# Altium schematic sheet DSP.SchDoc
size A3; SheetNumber: 5; SheetTotal: 5
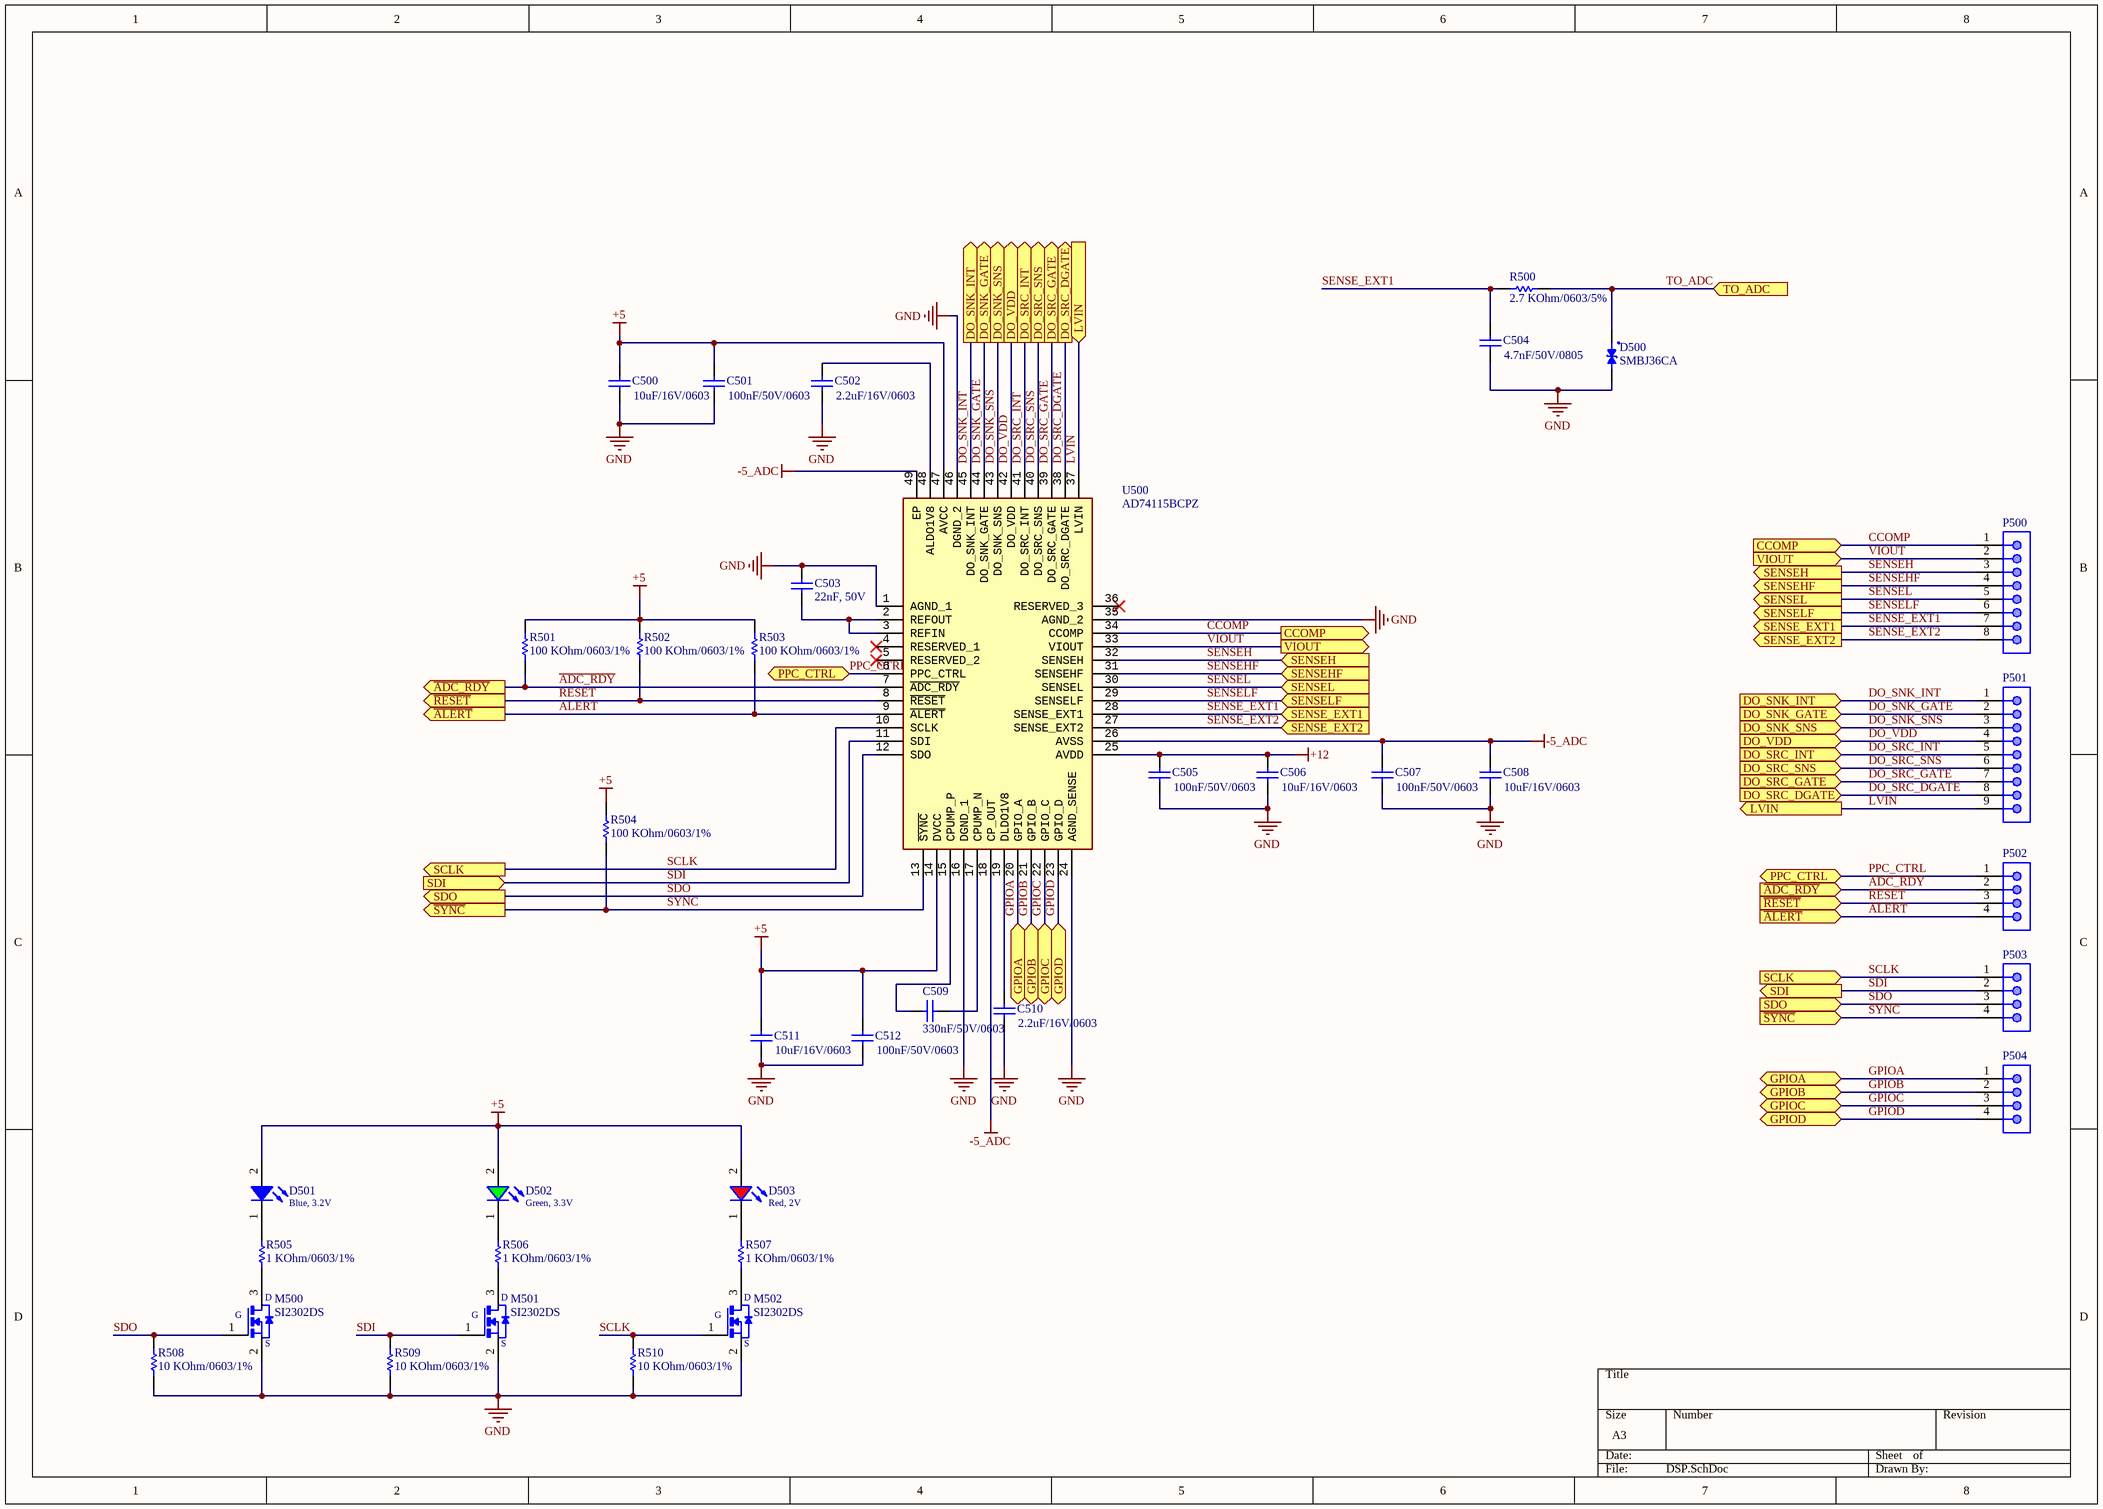
[diagram p0: DSP.SchDoc]

## Parts
C500  value 10uF/16V/0603  [WCAP-CSGP_0603_H=0.8mm_Reflow]  (hidden comment: 10uF, 6.3V)
C501  Capacitance: 100nF/50V/0603  [WCAP-CSGP_0603_H=0.8mm_Reflow]  (hidden comment: 100nF, 50V)
C502  value 2.2uF/16V/0603  [WCAP-CSGP_0603_H=0.8mm_Reflow]  (hidden comment: 2.2uF, 16V)
C503  22nF, 50V  [WCAP-CSGP_0603_H=0.8mm_Reflow]
C504  Capacitance: 4.7nF/50V/0805  [WCAP-CSGP_0805_H=1.25mm]  (hidden comment: 4.7nF, 100V)
C505  Capacitance: 100nF/50V/0603  [WCAP-CSGP_0603_H=0.8mm_Reflow]  (hidden comment: 100nF, 50V)
C506  value 10uF/16V/0603  [WCAP-CSGP_0603_H=0.8mm_Reflow]  (hidden comment: 10uF, 6.3V)
C507  Capacitance: 100nF/50V/0603  [WCAP-CSGP_0603_H=0.8mm_Reflow]  (hidden comment: 100nF, 50V)
C508  value 10uF/16V/0603  [WCAP-CSGP_0603_H=0.8mm_Reflow]  (hidden comment: 10uF, 6.3V)
C509  value 330nF/50V/0603  [WCAP-CSGP_0603_H=0.8mm_Reflow]  (hidden comment: 330nF, 50V)
C510  value 2.2uF/16V/0603  [WCAP-CSGP_0603_H=0.8mm_Reflow]  (hidden comment: 2.2uF, 16V)
C511  value 10uF/16V/0603  [WCAP-CSGP_0603_H=0.8mm_Reflow]  (hidden comment: 10uF, 6.3V)
C512  Capacitance: 100nF/50V/0603  [WCAP-CSGP_0603_H=0.8mm_Reflow]  (hidden comment: 100nF, 50V)
D500  SMBJ36CA  [DIOM4336X265N]
D501  Blue, 3.2V  [WL-SMCW_0603 dome]
D502  Green, 3.3V  [WL-SMCW_0603 dome]
D503  Red, 2V  [WL-SMCW_0603 dome]
M500  value SI2302DS  [SOT23]  (hidden comment: SI2302)
M501  value SI2302DS  [SOT23]  (hidden comment: SI2302)
M502  value SI2302DS  [SOT23]  (hidden comment: SI2302)
P500  61300811121  [61300811121]  (value not drawn)
P501  61300911121  [61300911121]  (value not drawn)
P502  61300411121  [61300411121]  (value not drawn)
P503  61300411121  [61300411121]  (value not drawn)
P504  61300411121  [61300411121]  (value not drawn)
R500  value 2.7 KOhm/0603/5%  [R0603]  (hidden comment: Resistor 2.7 KOhm 0603 5%)
R501  value 100 KOhm/0603/1%  [R0603]  (hidden comment: Resistor 100 KOhm 0603 1%)
R502  value 100 KOhm/0603/1%  [R0603]  (hidden comment: Resistor 100 KOhm 0603 1%)
R503  value 100 KOhm/0603/1%  [R0603]  (hidden comment: Resistor 100 KOhm 0603 1%)
R504  value 100 KOhm/0603/1%  [R0603]  (hidden comment: Resistor 100 KOhm 0603 1%)
R505  value 1 KOhm/0603/1%  [R0603]  (hidden comment: Resistor 1 KOhm 0603 1%)
R506  value 1 KOhm/0603/1%  [R0603]  (hidden comment: Resistor 1 KOhm 0603 1%)
R507  value 1 KOhm/0603/1%  [R0603]  (hidden comment: Resistor 1 KOhm 0603 1%)
R508  value 10 KOhm/0603/1%  [R0603]  (hidden comment: Resistor 10 KOhm 0603 1%)
R509  value 10 KOhm/0603/1%  [R0603]  (hidden comment: Resistor 10 KOhm 0603 1%)
R510  value 10 KOhm/0603/1%  [R0603]  (hidden comment: Resistor 10 KOhm 0603 1%)
U500  AD74115BCPZ  [QFN50P700X700X80-49N-D]

## Ports
CCOMP (in), CCOMP (out), DO_SNK_GATE (in), DO_SNK_GATE (out), DO_SNK_INT (in), DO_SNK_INT (out), DO_SNK_SNS (in), DO_SNK_SNS (out), DO_SRC_DGATE (in), DO_SRC_DGATE (out), DO_SRC_GATE (in), DO_SRC_GATE (out), DO_SRC_INT (in), DO_SRC_INT (out), DO_SRC_SNS (in), DO_SRC_SNS (out), DO_VDD (in), DO_VDD (out), GPIOA (bidir), GPIOB (bidir), GPIOC (bidir), GPIOD (bidir), LVIN (in), LVIN (out), PPC_CTRL (bidir), SCLK (in), SCLK (out), SDI (in), SDI (out), SDO (in), SDO (out), SENSE_EXT1 (in), SENSE_EXT1 (out), SENSE_EXT2 (in), SENSE_EXT2 (out), SENSEH (in), SENSEH (out), SENSEHF (in), SENSEHF (out), SENSEL (in), SENSEL (out), SENSELF (in), SENSELF (out), TO_ADC (in), VIOUT (in), VIOUT (out), ~{ADC_RDY} (in), ~{ADC_RDY} (out), ~{ALERT} (in), ~{ALERT} (out), ~{RESET} (in), ~{RESET} (out), ~{SYNC} (in), ~{SYNC} (out)

## Nets
+5: C500.2 C501.2 C511.2 C512.2 D501.2(A) D502.2(A) D503.2(A) R501.2 R502.2 R503.2 R504.1 U500.14(DVCC) U500.47(AVCC)
+12: C505.2 C506.2 U500.25(AVDD)
-5_ADC: C507.2 C508.2 U500.18(CP_OUT) U500.26(AVSS) U500.49(EP)
GND: C500.1 C501.1 C502.1 C503.2 C504.1 C505.1 C506.1 C507.1 C508.1 C510.1 C511.1 C512.1 D500.2 M500.2(S) M501.2(S) M502.2(S) R508.1 R509.1 R510.1 U500.1(AGND_1) U500.16(DGND_1) U500.24(AGND_SENSE) U500.35(AGND_2) U500.46(DGND_2)
~{ADC_RDY}: P502.2 R501.1 U500.7(~{ADC_RDY}) ; port ~{ADC_RDY}
~{ALERT}: P502.4 R503.1 U500.9(~{ALERT}) ; port ~{ALERT}
CCOMP: P500.1 U500.34(CCOMP) ; port CCOMP
DO_SNK_GATE: P501.2 U500.44(DO_SNK_GATE) ; port DO_SNK_GATE
DO_SNK_INT: P501.1 U500.45(DO_SNK_INT) ; port DO_SNK_INT
DO_SNK_SNS: P501.3 U500.43(DO_SNK_SNS) ; port DO_SNK_SNS
DO_SRC_DGATE: P501.8 U500.38(DO_SRC_DGATE) ; port DO_SRC_DGATE
DO_SRC_GATE: P501.7 U500.39(DO_SRC_GATE) ; port DO_SRC_GATE
DO_SRC_INT: P501.5 U500.41(DO_SRC_INT) ; port DO_SRC_INT
DO_SRC_SNS: P501.6 U500.40(DO_SRC_SNS) ; port DO_SRC_SNS
DO_VDD: P501.4 U500.42(DO_VDD) ; port DO_VDD
GPIOA: P504.1 U500.20(GPIO_A) ; port GPIOA
GPIOB: P504.2 U500.21(GPIO_B) ; port GPIOB
GPIOC: P504.3 U500.22(GPIO_C) ; port GPIOC
GPIOD: P504.4 U500.23(GPIO_D) ; port GPIOD
LVIN: P501.9 U500.37(LVIN) ; port LVIN
PPC_CTRL: P502.1 U500.6(PPC_CTRL) ; port PPC_CTRL
~{RESET}: P502.3 R502.1 U500.8(~{RESET}) ; port ~{RESET}
~{SYNC}: P503.4 R504.2 U500.13(~{SYNC}) ; port ~{SYNC}
SCLK: M502.1(G) P503.1 R510.2 U500.10(SCLK) ; port SCLK
SDI: M501.1(G) P503.2 R509.2 U500.11(SDI) ; port SDI
SDO: M500.1(G) P503.3 R508.2 U500.12(SDO) ; port SDO
SENSE_EXT1: C504.2 P500.7 R500.1 U500.28(SENSE_EXT1) ; port SENSE_EXT1
SENSE_EXT2: P500.8 U500.27(SENSE_EXT2) ; port SENSE_EXT2
SENSEH: P500.3 U500.32(SENSEH) ; port SENSEH
SENSEHF: P500.4 U500.31(SENSEHF) ; port SENSEHF
SENSEL: P500.5 U500.30(SENSEL) ; port SENSEL
SENSELF: P500.6 U500.29(SENSELF) ; port SENSELF
TO_ADC: D500.1 R500.2 ; port TO_ADC
VIOUT: P500.2 U500.33(VIOUT) ; port VIOUT
NetC502_2: C502.2 U500.48(ALDO1V8)
NetC503_1: C503.1 U500.2(REFOUT) U500.3(REFIN)
NetC509_1: C509.1 U500.17(CPUMP_N)
NetC509_2: C509.2 U500.15(CPUMP_P)
NetC510_2: C510.2 U500.19(DLDO1V8)
NetD501_1: D501.1(K) R505.2
NetD502_1: D502.1(K) R506.2
NetD503_1: D503.1(K) R507.2
NetM500_3: M500.3(D) R505.1
NetM501_3: M501.3(D) R506.1
NetM502_3: M502.3(D) R507.1

Not connected (* = marked no-connect by the designer): U500 4(RESERVED_1)* 5(RESERVED_2)* 36(RESERVED_3)*

## Library data of the parts
C500 C506 C508 C511 = 885012106006: WCAP-CSGP Multilayer Ceramic Chip Capacitor, General Purpose, size 0603, X5R, 10uF, 6.3V; Manufacturer: Wurth Elektronik; Rated Voltage: 6.3VDC; Isolation Resistance: >=0.01GOhm; Capacitance Tolerance: +/-20%; Technical Reference: X5R0603106M6R3DFCT10000; ComponentLink1Description: Manufacturer; ComponentLink1URL: http://www.we-online.de; ComponentLink2Description: Datasheet; ComponentLink2URL: https://www.we-online.com/catalog/datasheet/885012106006.pdf; Operating Temperature: -55 to +85degC; Packaging: Tape and Reel; Manufacturer Part Number: 885012106006; Published Date: May 2020; Ceramic Type: X5R; Dissipation Factor: =<10%; Height: 0.8mm; Mounting Technology: SMT; Size: 0603
C501 C505 C507 C512 = 885012206095: WCAP-CSGP Multilayer Ceramic Chip Capacitor, General Purpose, size 0603, X7R, 100nF, 50V; Manufacturer: Wurth Elektronik; Rated Voltage: 50VDC; Isolation Resistance: >=5GOhm; Capacitance Tolerance: +/-10%; Technical Reference: X7R0603104K050DFCT10000; ComponentLink1Description: Manufacturer; ComponentLink1URL: http://www.we-online.de; ComponentLink2Description: Datasheet; ComponentLink2URL: https://www.we-online.com/catalog/datasheet/885012206095.pdf; Operating Temperature: -55 to +125degC; Packaging: Tape and Reel; Manufacturer Part Number: 885012206095; Published Date: May 2020; Ceramic Type: X7R; Dissipation Factor: =<3%; Height: 0.8mm; Mounting Technology: SMT; Size: 0603
C502 C510 = 885012106018: WCAP-CSGP Multilayer Ceramic Chip Capacitor, General Purpose, size 0603, X5R, 2.2uF, 16V; Manufacturer: Wurth Elektronik; Rated Voltage: 16VDC; Isolation Resistance: >=0.05GOhm; Capacitance Tolerance: +/-20%; Technical Reference: X5R0603225M016DFCT10000; ComponentLink1Description: Manufacturer; ComponentLink1URL: http://www.we-online.de; ComponentLink2Description: Datasheet; ComponentLink2URL: https://www.we-online.com/catalog/datasheet/885012106018.pdf; Operating Temperature: -55 to +85degC; Packaging: Tape and Reel; Manufacturer Part Number: 885012106018; Published Date: May 2020; Ceramic Type: X5R; Dissipation Factor: =<10%; Height: 0.8mm; Mounting Technology: SMT; Size: 0603
C503 = 885012206091: WCAP-CSGP Multilayer Ceramic Chip Capacitor, General Purpose, size 0603, X7R, 22nF, 50V; Manufacturer: Wurth Elektronik; Rated Voltage: 50VDC; Isolation Resistance: >=10GOhm; Capacitance Tolerance: +/-10%; Technical Reference: X7R0603223K050DFCT10000; ComponentLink1Description: Manufacturer; ComponentLink1URL: http://www.we-online.de; ComponentLink2Description: Datasheet; ComponentLink2URL: https://www.we-online.com/catalog/datasheet/885012206091.pdf; Operating Temperature: -55 to +125degC; Packaging: Tape and Reel; Manufacturer Part Number: 885012206091; Published Date: May 2020; Ceramic Type: X7R; Dissipation Factor: =<2.5%; Height: 0.8mm; Mounting Technology: SMT; Size: 0603; Capacitance: 22nF
C504 = 885012007092: WCAP-CSGP Multilayer Ceramic Chip Capacitor, General Purpose, size 0805, NP0, 4.7nF, 100V; Manufacturer: Wurth Elektronik; Rated Voltage: 100VDC; Isolation Resistance: >=10GOhm; Capacitance Tolerance: +/-5%; Dissipation Factor: Q>=1000; Technical Reference: NP00805472J100DFCT10000; ComponentLink1Description: Manufacturer; ComponentLink1URL: http://www.we-online.de; ComponentLink2Description: Datasheet; ComponentLink2URL: https://www.we-online.com/catalog/datasheet/885012007092.pdf; Operating Temperature: -55 to +125degC; Packaging: Tape and Reel; Manufacturer Part Number: 885012007092; Published Date: May 2020; Ceramic Type: NP0; Height: 1.25mm; Mounting Technology: SMT; Size: 0805
C509 = 885012206121: WCAP-CSGP Multilayer Ceramic Chip Capacitor, General Purpose, size 0603, X7R, 330nF, 50V; Manufacturer: Wurth Elektronik; Rated Voltage: 50VDC; Isolation Resistance: >=1.5GOhm; Capacitance Tolerance: +/-10%; Technical Reference: X7R0603334K050DFCT10000; ComponentLink1Description: Manufacturer; ComponentLink1URL: http://www.we-online.de; ComponentLink2Description: Datasheet; ComponentLink2URL: https://www.we-online.com/catalog/datasheet/885012206121.pdf; Operating Temperature: -55 to +125degC; Packaging: Tape and Reel; Manufacturer Part Number: 885012206121; Published Date: May 2020; Ceramic Type: X7R; Dissipation Factor: =<10%; Height: 0.8mm; Mounting Technology: SMT; Size: 0603
D500 = SMBJ36CA: 600W, 42.1V, 5%, Bidirectional, TVS; MF: Taiwan Semiconductor; SnapEDA_Link: https://www.snapeda.com/parts/SMBJ36CA/Taiwan+Semiconductor/view-part/?ref=snap; Package: SMB Taiwan Semiconductor; MP: SMBJ36CA; Check_prices: https://www.snapeda.com/parts/SMBJ36CA/Taiwan+Semiconductor/view-part/?ref=eda; Purchase-URL: https://pricing.snapeda.com/search/part/SMBJ36CA/?ref=eda; Price: None; Availability: In Stock; ComponentLink1Description: Buy; ComponentLink1URL: https://www.thegioiic.com/smbj36ca; Value: SMBJ36CA
D501 = 150060BS84000: WL-SMCW SMT Mono-color Chip LED Waterclear, size 0603 dome, Blue, 3.2V, 40deg; Chip Technology: InGaN; Dominant Wavelength typ.: 470nm; Luminous Intensity typ.: 560mcd; Peak Wavelength typ.: 465nm; Viewing Angle: 40deg; ComponentLink1Description: Manufacturer; ComponentLink1URL: http://www.we-online.de; ComponentLink2URL: https://www.we-online.com/catalog/datasheet/150060BS84000.pdf; ComponentLink2Description: Datasheet; Forward Voltage typ.: 3.2V; Emitting Color: Blue; Mounting Technology: SMT; Operating Temperature: -40 to +85degC; Published Date: December 2019; Part Number: 150060BS84000; Packaging: Tape and Reel; Size: 0603 dome; Publisher: Wurth Elektronik
D502 = 150060GS84000: WL-SMCW SMT Mono-color Chip LED Waterclear, size 0603 dome, Green, 3.3V, 40deg; Chip Technology: InGaN; Dominant Wavelength typ.: 525nm; Luminous Intensity typ.: 3000mcd; Peak Wavelength typ.: 520nm; Viewing Angle: 40deg; ComponentLink1Description: Manufacturer; ComponentLink1URL: http://www.we-online.de; ComponentLink2URL: https://www.we-online.com/catalog/datasheet/150060GS84000.pdf; ComponentLink2Description: Datasheet; Forward Voltage typ.: 3.3V; Emitting Color: Green; Mounting Technology: SMT; Operating Temperature: -40 to +85degC; Published Date: December 2019; Part Number: 150060GS84000; Packaging: Tape and Reel; Size: 0603 dome; Publisher: Wurth Elektronik
D503 = 150060RS86000: WL-SMCW SMT Mono-color Chip LED Waterclear, size 0603 dome, Red, 2V, 60deg; Chip Technology: AlInGaP; Dominant Wavelength typ.: 624nm; Luminous Intensity typ.: 800mcd; Peak Wavelength typ.: 632nm; Viewing Angle: 60deg; ComponentLink1Description: Manufacturer; ComponentLink1URL: http://www.we-online.de; ComponentLink2URL: https://www.we-online.com/catalog/datasheet/150060RS86000.pdf; ComponentLink2Description: Datasheet; Forward Voltage typ.: 2V; Emitting Color: Red; Mounting Technology: SMT; Operating Temperature: -40 to +85degC; Published Date: December 2019; Part Number: 150060RS86000; Packaging: Tape and Reel; Size: 0603 dome; Publisher: Wurth Elektronik
M500-M502 = SI2302: N-Channel 20 V 2.6A (Ta) 710mW (Ta) Surface Mount SOT-23-3 (TO-236); MF: Vishay Siliconix; Price: None; Availability: In Stock; Package: SOT-23-3 Vishay Siliconix; MP: SI2302; SnapEDA_Link: https://www.snapeda.com/parts/SI2302/Vishay+Siliconix/view-part/?ref=snap; Purchase-URL: https://pricing.snapeda.com/search/part/SI2302/?ref=eda; Check_prices: https://www.snapeda.com/parts/SI2302/Vishay+Siliconix/view-part/?ref=eda; ComponentLink1Description: Buy; ComponentLink1URL: https://www.thegioiic.com/si2302ds-mosfet-kenh-n-20v-2-5a-sot23
P500 = 61300811121: WR-PHD Pin Header, THT, pitch 2.54mm, Single Row, Vertical, 8p; Manufacturer: Wurth Elektronik; Pin Number: 8; Rated Current: 3A; Working Voltage: 250VAC; Withstanding Voltage: 500VAC; Contact Resistance: 20mOhm; ComponentLink1Description: Manufacturer; ComponentLink1URL: http://www.we-online.de; ComponentLink2Description: Datasheet; ComponentLink2URL: https://www.we-online.com/catalog/datasheet/61300811121.pdf; Manufacturer Part Number: 61300811121; Published Date: May 2020; Pitch: 2.54mm; Operating Temperature: -40 to +105degC; Mounting Technology: THT; Packaging: Bag; Gender: Pin Header; Row Number: Single; Orientation: Vertical
P501 = 61300911121: WR-PHD Pin Header, THT, pitch 2.54mm, Single Row, Vertical, 9p; Manufacturer: Wurth Elektronik; Pin Number: 9; Rated Current: 3A; Working Voltage: 250VAC; Withstanding Voltage: 500VAC; Contact Resistance: 20mOhm; ComponentLink1Description: Manufacturer; ComponentLink1URL: http://www.we-online.de; ComponentLink2Description: Datasheet; ComponentLink2URL: https://www.we-online.com/catalog/datasheet/61300911121.pdf; Manufacturer Part Number: 61300911121; Published Date: May 2020; Pitch: 2.54mm; Operating Temperature: -40 to +105degC; Mounting Technology: THT; Packaging: Bag; Gender: Pin Header; Row Number: Single; Orientation: Vertical
P502-P504 = 61300411121: WR-PHD Pin Header, THT, pitch 2.54mm, Single Row, Vertical, 4p; Manufacturer: Wurth Elektronik; Pin Number: 4; Rated Current: 3A; Working Voltage: 250VAC; Withstanding Voltage: 500VAC; Contact Resistance: 20mOhm; ComponentLink1Description: Manufacturer; ComponentLink1URL: http://www.we-online.de; ComponentLink2Description: Datasheet; ComponentLink2URL: https://www.we-online.com/catalog/datasheet/61300411121.pdf; Manufacturer Part Number: 61300411121; Published Date: May 2020; Pitch: 2.54mm; Operating Temperature: -40 to +105degC; Mounting Technology: THT; Packaging: Bag; Gender: Pin Header; Row Number: Single; Orientation: Vertical
R500 = Resistor 2.7 KOhm 0603 5%: Code 272, 1/10W; ComponentLink1Description: Buy; ComponentLink1URL: https://www.thegioiic.com/dien-tro-2-7-kohm-0603-5-
R501-R504 = Resistor 100 KOhm 0603 1%: Code 104, 1/10W; ComponentLink1Description: Buy; ComponentLink1URL: https://www.thegioiic.com/dien-tro-100-kohm-0603-1-
R505-R507 = Resistor 1 KOhm 0603 1%: Code 102, 1/10W; ComponentLink1Description: Buy; ComponentLink1URL: https://www.thegioiic.com/dien-tro-1-kohm-0603-1
R508-R510 = Resistor 10 KOhm 0603 1%: Code 103, 1/10W; ComponentLink1Description: Buy; ComponentLink1URL: https://www.thegioiic.com/dien-tro-10-kohm-0603-1-
U500 = AD74115BCPZ: Single-Channel, Software Configurable Input and Output; Manufacturer_Name: Analog Devices; Geometry.Height: 0.8mm; Manufacturer_Part_Number: AD74115BCPZ; Mouser Part Number: 584-AD74115BCPZ; Mouser Price/Stock: https://www.mouser.co.uk/ProductDetail/Analog-Devices/AD74115BCPZ?qs=Jm2GQyTW%2FbiQ8agDBTeo0A%3D%3D; Arrow Part Number: *; Arrow Price/Stock: *; Datasheet Link: https://www.analog.com/AD74115/datasheet; Value: AD74115BCPZ